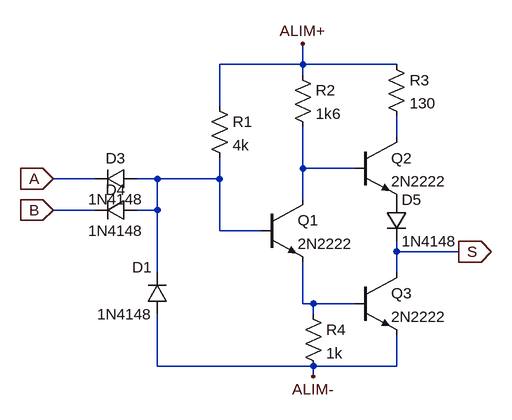
[diagram p0: schematic 7400.asc]
7400.asc, the LTspice schematic file:
Version 4
SHEET 1 880 680
WIRE -80 -96 -80 -128
WIRE -80 -96 -208 -96
WIRE 64 -96 -80 -96
WIRE -80 -80 -80 -96
WIRE -208 -32 -208 -96
WIRE 64 16 64 -16
WIRE -80 64 -80 0
WIRE 0 64 -80 64
WIRE -400 80 -464 80
WIRE -304 80 -336 80
WIRE -208 80 -208 48
WIRE -208 80 -304 80
WIRE -80 112 -80 64
WIRE -400 128 -464 128
WIRE -304 128 -304 80
WIRE -304 128 -336 128
WIRE -208 160 -208 80
WIRE -144 160 -208 160
WIRE 64 192 64 176
WIRE 160 192 64 192
WIRE -304 224 -304 128
WIRE 64 224 64 192
WIRE -80 272 -80 208
WIRE -64 272 -80 272
WIRE 0 272 -64 272
WIRE -64 288 -64 272
WIRE -304 368 -304 288
WIRE -64 368 -304 368
WIRE 64 368 64 320
WIRE 64 368 -64 368
WIRE -64 384 -64 368
FLAG -464 80 A
IOPIN -464 80 In
FLAG -464 128 B
IOPIN -464 128 In
FLAG 160 192 S
IOPIN 160 192 Out
FLAG -80 -128 ALIM+
FLAG -64 384 ALIM-
SYMBOL diode -288 288 R180
WINDOW 0 24 72 Left 0
WINDOW 3 24 0 Left 0
SYMATTR InstName D1
SYMATTR Value 1N4148
SYMBOL diode -336 64 R90
WINDOW 0 0 32 VBottom 0
WINDOW 3 32 32 VTop 0
SYMATTR InstName D3
SYMATTR Value 1N4148
SYMBOL diode -336 112 R90
WINDOW 0 0 32 VBottom 0
WINDOW 3 32 32 VTop 0
SYMATTR InstName D4
SYMATTR Value 1N4148
SYMBOL res -224 -48 R0
SYMATTR InstName R1
SYMATTR Value 4k
SYMBOL res -96 -96 R0
SYMATTR InstName R2
SYMATTR Value 1k6
SYMBOL res 48 -112 R0
SYMATTR InstName R3
SYMATTR Value 130
SYMBOL npn -144 112 R0
SYMATTR InstName Q1
SYMATTR Value 2N2222
SYMBOL npn 0 16 R0
SYMATTR InstName Q2
SYMATTR Value 2N2222
SYMBOL diode 48 112 R0
SYMATTR InstName D5
SYMATTR Value 1N4148
SYMBOL npn 0 224 R0
SYMATTR InstName Q3
SYMATTR Value 2N2222
SYMBOL res -80 272 R0
SYMATTR InstName R4
SYMATTR Value 1k

The netlist it stands for:
* 7400.asc
D1 ALIM- N003 1N4148
D3 N003 A 1N4148
D4 N003 B 1N4148
R1 ALIM+ N003 4k
R2 ALIM+ N002 1k6
R3 ALIM+ N001 130
Q1 N002 N003 N004 0 2N2222
Q2 N001 N002 P001 0 2N2222
D5 P001 S 1N4148
Q3 S N004 ALIM- 0 2N2222
R4 N004 ALIM- 1k
.model D D
.lib standard.dio
.model NPN NPN
.model PNP PNP
.lib standard.bjt
.backanno
.end